# Altium schematic sheet Power_subsystem.SchDoc
size B; Organization: Altium Limited; Address1: L3, 12a Rodborough Rd; Address2: Frenchs Forest; Address3: NSW; Address4: Australia 2086
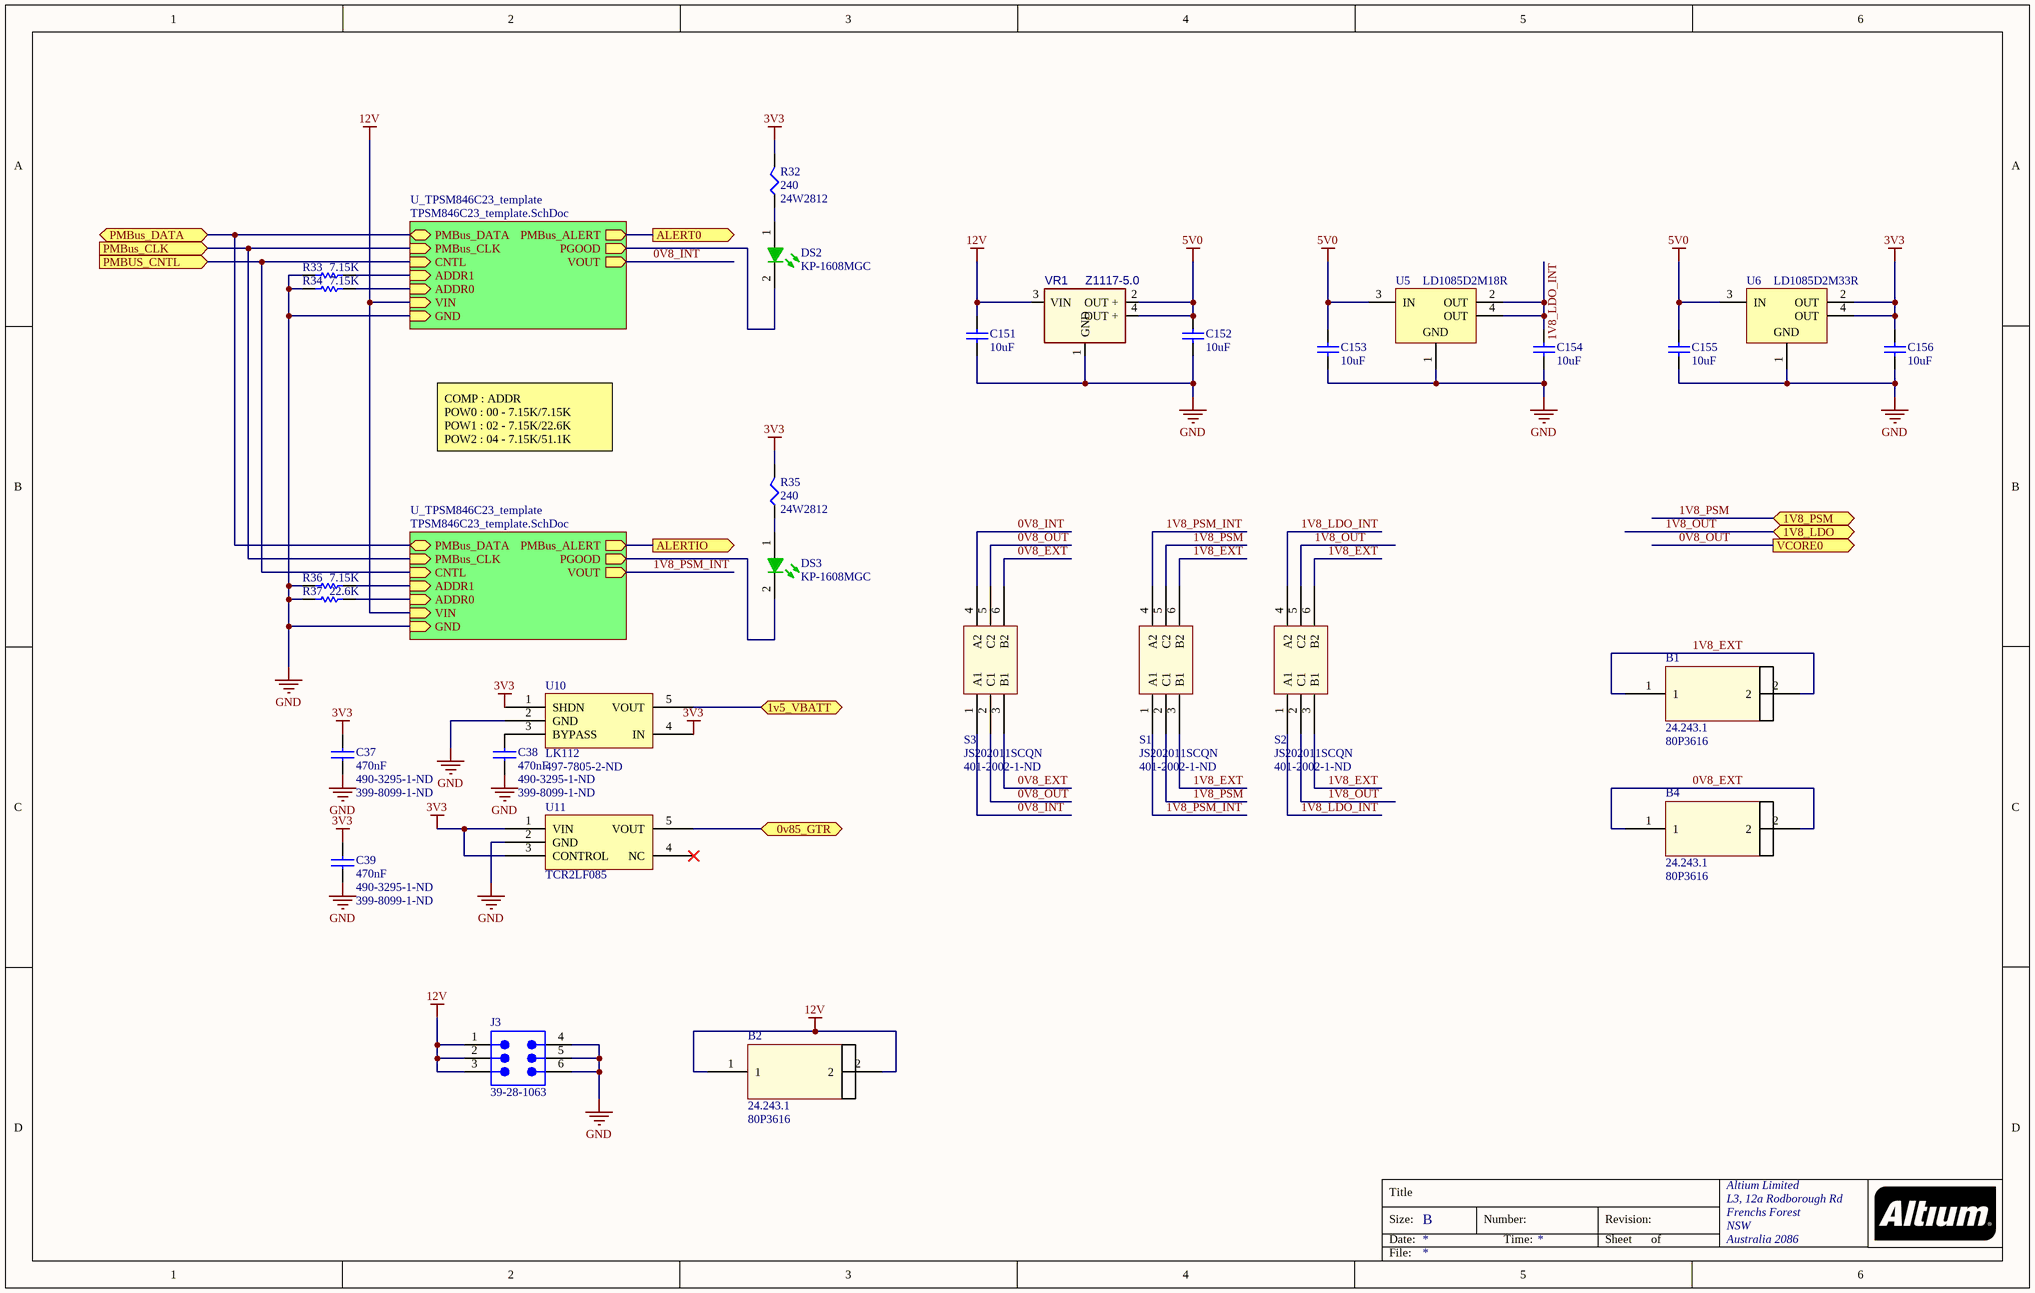
[diagram p0: Power_subsystem.SchDoc]

## Parts
B1  24.243.1  Supplier Part Number 1: 80P3616  [banana_clip]
B2  24.243.1  Supplier Part Number 1: 80P3616  [banana_clip]
B4  24.243.1  Supplier Part Number 1: 80P3616  [banana_clip]
C37  Capacitance: 470nF  Supplier Part Number 1: 490-3295-1-ND  Supplier Part Number 2: 399-8099-1-ND  [CAPC1005X06N]  (hidden comment: CAP_470nF_1608mm_0603mil_1)
C38  Capacitance: 470nF  Supplier Part Number 1: 490-3295-1-ND  Supplier Part Number 2: 399-8099-1-ND  [CAPC1005X06N]  (hidden comment: CAP_470nF_1608mm_0603mil_1)
C39  Capacitance: 470nF  Supplier Part Number 1: 490-3295-1-ND  Supplier Part Number 2: 399-8099-1-ND  [CAPC1005X06N]  (hidden comment: CAP_470nF_1608mm_0603mil_1)
C151  10uF  [CAPC0805(2012)145_N]
C152  10uF  [CAPC0805(2012)145_N]
C153  10uF  [CAPC0805(2012)145_N]
C154  10uF  [CAPC0805(2012)145_N]
C155  10uF  [CAPC0805(2012)145_N]
C156  10uF  [CAPC0805(2012)145_N]
DS2  KP-1608MGC  [KING-0603LED_GREEN_V]
DS3  KP-1608MGC  [KING-0603LED_GREEN_V]
J3  39-28-1063  [MOLX-39-28-1063_V]
R32  Resistance: 240  Supplier Part Number 1: 24W2812  [RESC1608X06N]  (hidden comment: RES_240_0603)
R33  7.15K  [RESC0402(1005)_N]
R34  7.15K  [RESC0402(1005)_N]
R35  Resistance: 240  Supplier Part Number 1: 24W2812  [RESC1608X06N]  (hidden comment: RES_240_0603)
R36  7.15K  [RESC0402(1005)_N]
R37  22.6K  [RESC0402(1005)_N]
S1  JS202011SCQN  Supplier Part Number 1: 401-2002-1-ND  [JS202011SCQN_auto]
S2  JS202011SCQN  Supplier Part Number 1: 401-2002-1-ND  [JS202011SCQN_auto]
S3  JS202011SCQN  Supplier Part Number 1: 401-2002-1-ND  [JS202011SCQN_auto]
U5  LD1085D2M18R  [D2PAK_A_M]
U6  LD1085D2M33R  [D2PAK_A_L]
U10  LK112  Supplier Part Number 1: 497-7805-2-ND  [SOT95P280X110-5N]
U11  TCR2LF085  [SOT95P280X110-5N]
VR1  Z1117-5.0  [SOT-223]

## Sub-sheets
U_TPSM846C23_template = TPSM846C23_template.SchDoc: PMBus_DATA (bidir), PMBus_CLK (in), PMBus_ALERT (out), CNTL (in), ADDR1 (in), ADDR0 (in), PGOOD (out), VIN (in), GND (in), VOUT (out)
U_TPSM846C23_template = TPSM846C23_template.SchDoc: PMBus_DATA (bidir), PMBus_CLK (in), PMBus_ALERT (out), CNTL (in), ADDR1 (in), ADDR0 (in), PGOOD (out), VIN (in), GND (in), VOUT (out)

## Ports
0v85_GTR (bidir), 1v5_VBATT (bidir), 1V8_LDO (bidir), 1V8_PSM (bidir), ALERT0 (out), ALERTIO (out), PMBus_CLK (in), PMBUS_CNTL (in), PMBus_DATA (bidir), VCORE0 (out)

## Nets
3V3: C37.1 C39.1 C156.2 R32.1 R35.1 U6.2(OUT) U6.4(OUT) U10.1(SHDN) U10.4(IN) U11.1(VIN) U11.3(CONTROL)
5V0: C152.2 C153.2 C155.2 U5.3(IN) U6.3(IN) VR1.2(OUT_+) VR1.4(OUT_+)
12V: B2.1 B2.2 C151.2 J3.1 J3.2 J3.3 VR1.3(VIN) ; sheet U_TPSM846C23_template/VIN, sheet U_TPSM846C23_template/VIN
GND: C37.2 C38.2 C39.2 C151.1 C152.1 C153.1 C154.1 C155.1 C156.1 J3.4 J3.5 J3.6 R33.1 R34.1 R36.1 R37.1 U5.1(GND) U6.1(GND) U10.2(GND) U11.2(GND) VR1.1(GND) ; sheet U_TPSM846C23_template/GND, sheet U_TPSM846C23_template/GND
0V8_EXT: B4.1 B4.2 S3.3(B1) S3.6(B2)
0V8_INT: S3.1(A1) S3.4(A2) ; sheet U_TPSM846C23_template/VOUT
0V8_OUT: S3.2(C1) S3.5(C2) ; port VCORE0
0v85_GTR: U11.5(VOUT) ; port 0v85_GTR
1v5_VBATT: U10.5(VOUT) ; port 1v5_VBATT
1V8_EXT: B1.1 B1.2 S1.3(B1) S1.6(B2) S2.3(B1) S2.6(B2)
1V8_LDO_INT: C154.2 S2.1(A1) S2.4(A2) U5.2(OUT) U5.4(OUT)
1V8_OUT: S2.2(C1) S2.5(C2) ; port 1V8_LDO
1V8_PSM: S1.2(C1) S1.5(C2) ; port 1V8_PSM
1V8_PSM_INT: S1.1(A1) S1.4(A2) ; sheet U_TPSM846C23_template/VOUT
ALERT0: port ALERT0, sheet U_TPSM846C23_template/PMBus_ALERT
ALERTIO: port ALERTIO, sheet U_TPSM846C23_template/PMBus_ALERT
PMBus_CLK: port PMBus_CLK, sheet U_TPSM846C23_template/PMBus_CLK, sheet U_TPSM846C23_template/PMBus_CLK
PMBUS_CNTL: port PMBUS_CNTL, sheet U_TPSM846C23_template/CNTL, sheet U_TPSM846C23_template/CNTL
PMBus_DATA: port PMBus_DATA, sheet U_TPSM846C23_template/PMBus_DATA, sheet U_TPSM846C23_template/PMBus_DATA
NetC38_1: C38.1 U10.3(BYPASS)
NetDS2_1: DS2.1(A) R32.2
NetDS2_2: DS2.2(K) ; sheet U_TPSM846C23_template/PGOOD
NetDS3_1: DS3.1(A) R35.2
NetDS3_2: DS3.2(K) ; sheet U_TPSM846C23_template/PGOOD
NetR33_2: R33.2 ; sheet U_TPSM846C23_template/ADDR1
NetR34_2: R34.2 ; sheet U_TPSM846C23_template/ADDR0
NetR36_2: R36.2 ; sheet U_TPSM846C23_template/ADDR1
NetR37_2: R37.2 ; sheet U_TPSM846C23_template/ADDR0

Not connected (* = marked no-connect by the designer): U11 4(NC)*

## Notes on the sheet
- COMP : ADDR
  POW0 : 00 - 7.15K/7.15K
  POW1 : 02 - 7.15K/22.6K
  POW2 : 04 - 7.15K/51.1K
- Title
- Size:
- Date:
- B
- Number:
- Time:
- Revision:
- Sheet
- of
- File:

## Library data of the parts
C37-C39 = CAP_470nF_1608mm_0603mil_1: 0.47uF Capacitor; Manufacturer: Murata; Manufacturer Part Number: GRM155R61E225ME15D; Voltage Rating: 25V; Tolerance: 20%; Dielectric: X5R; ComponentLink1URL: http://search.murata.co.jp/Ceramy/image/img/A01X/G101/ENG/GRM0335C1E120JA01-01.pdf; ComponentLink1Description: http://search.murata.co.jp/Ceramy/image/img/A01X/G101/ENG/GRM0335C1E120JA01-01.pdf; ComponentLink2URL: http://search.murata.co.jp/Ceramy/image/img/A01X/partnumbering_e_01.pdf; ComponentLink2Description: http://search.murata.co.jp/Ceramy/image/img/A01X/partnumbering_e_01.pdf; ComponentLink3URL: http://www1.futureelectronics.com/doc/SAMSUNG/CL03A104KQ3NNNC.pdf; ComponentLink3Description: http://www1.futureelectronics.com/doc/SAMSUNG/CL03A104KQ3NNNC.pdf; ComponentLink4URL: https://www.distrelec.biz/Web/Downloads/_e/ng/MLCC_CatalogDownload2013_ENG.pdf?mime=application%2Fpdf; ComponentLink4Description: https://www.distrelec.biz/Web/Downloads/_e/ng/MLCC_CatalogDownload2013_ENG.pdf?mime=application%2Fpdf; ComponentLink5URL: https://www.verical.com/server-webapp/html/getDatasheet?partID=355266; ComponentLink5Description: https://www.verical.com/server-webapp/html/getDatasheet?partID=355266; ComponentLink6URL: http://psearch.murata.com/capacitor/product/GCM155R71H103KA55%23.pdf; ComponentLink6Description: http://psearch.murata.com/capacitor/product/GCM155R71H103KA55%23.pdf; ComponentLink7URL: https://www.verical.com/server-webapp/html/getDatasheet?partID=27433; ComponentLink7Description: https://www.verical.com/server-webapp/html/getDatasheet?partID=27433; ComponentLink8URL: http://psearch.en.murata.com/capacitor/product/GCM155R71H103KA55%23.pdf; ComponentLink8Description: http://psearch.en.murata.com/capacitor/product/GCM155R71H103KA55%23.pdf; ComponentLink9URL: http://search.murata.co.jp/Ceramy/image/img/A01X/partnumbering_e_02.pdf; ComponentLink9Description: http://search.murata.co.jp/Ceramy/image/img/A01X/partnumbering_e_02.pdf; ComponentLink10URL: http://uk.rs-online.com/webdocs/0ef9/0900766b80ef92d0.pdf; ComponentLink10Description: http://uk.rs-online.com/webdocs/0ef9/0900766b80ef92d0.pdf; Stock 1: 100000; Pricing 1: 1=0.34, 10=0.23, 100=0.1163, 500=0.0796, 1000=0.07041, 2500=0.06735, 5000=0.06123 (USD); Mount: Surface Mount; Case/Package: 0402; Weight: 0.000212oz; Case Code (Metric): 1005; Case Code (Imperial): 0402; Min Operating Temperature: -55°C; Max Operating Temperature: 85°C; Packaging: Tape and Reel; Termination: SMD/SMT; Voltage Rating (DC): 25V; Package Quantity: 10000; Length: 0.039inch; Height: 0.5mm; Width: 0.02inch; Thickness: 0.022inch; Supplier 1: Digi-Key; Supplier 2: Digi-Key
C151-C156 = CAP_0805
DS2 DS3 = CMP-0404-00001-1: LED, SMT, 0603(1608), 1.1mm thickness, Green; Manufacturer: Kingbright; Reverse Voltage: 5 V; Power Dissipation: 75 mW; Forward Current: 30 mA; Packing Type: 2000 pcs / reel; Mounting Technology: Surface Mount; Storage Temperature: -40 to +85 degC; ComponentLink1URL: http://www.kingbright.com/; PackageDescription: 2-Pin SMT LED, 1.6 x 0.8 mm Pitch; PartNumber: KP-1608MGC; PackageReference: 0603LED_GREEN; ComponentLink1Description: Manufacturer URL
J3 = CMP-1594-00001-1: 4.2 mm Pitch Mini-Fit Jr.Power Connector, Vertical, Through Hole, 6 Circuits, -40 to 105 degC, RoHS, Bag; Pitch: 4.2 mm; No. of Positions: 6; No. of Rows: 2; PartNumber: 39-28-1063; ComponentLink3Description: Package Specification; ComponentLink1URL: http://www.molex.com/; PackageVersion: Rev. F, 06/2009; Orientation: Vertical; ComponentLink3URL: http://www.molex.com/pdm_docs/sd/039281063_sd.pdf; ComponentLink2Description: Datasheet; PackageDescription: 6-Pin PCB Header, Vertical, Pitch 4.2 mm, Through Hole; ComponentLink1Description: Manufacturer URL; Temperature Min: -40 degC; RoHS: TRUE; Packing: Bag; Mounting Technology: Through Hole; Temperature Max: 105 degC; ComponentLink2URL: http://www.molex.com/webdocs/datasheets/pdf/en-us/0039281063_PCB_HEADERS.pdf
R32 R35 = RES_240_0603: Res Thin Film 0603 240 Ohm 0.1% 0.1W(1/10W) ±25ppm/C Molded SMD Automotive Punched T/R; Manufacturer: Panasonic; Manufacturer Part Number: ERA-3AEB101V; Power Rating: 100mW; Voltage Rating: 75V; Temperature Coefficient: 25ppm/°C; ComponentLink1URL: https://www.rohm.com/datasheet/ESR01MZPF/esr-e; ComponentLink1Description: https://www.rohm.com/datasheet/ESR01MZPF/esr-e; Stock 1: 511300; Pricing 1: 1=0.35, 10=0.3, 100=0.1172, 1000=0.04906, 2500=0.04498 (USD); Mount: Surface Mount; Case/Package: 0603; Number of Pins: 2; Case Code (Metric): 1608; Case Code (Imperial): 0603; Contact Plating: Tin; Min Operating Temperature: -55°C; Max Operating Temperature: 155°C; Tolerance: 0.1%; Packaging: Tape and Reel; Package Quantity: 5000; Composition: Metal Film,Thin Film; Number of Terminations: 2; Termination: SMD/SMT; Military Standard: Not; Max Power Dissipation: 100mW; Length: 1.6mm; Height: 0.45mm; Width: 0.8mm; Depth: 0.8mm; Radiation Hardening: No; REACH SVHC: No SVHC; ComponentLink2URL: http://www.farnell.com/datasheets/485442.pdf; ComponentLink2Description: http://www.farnell.com/datasheets/485442.pdf; ComponentLink3URL: http://industrial.panasonic.com/www-data/pdf/AOA0000/AOA0000CE26.pdf; ComponentLink3Description: http://industrial.panasonic.com/www-data/pdf/AOA0000/AOA0000CE26.pdf; ComponentLink4URL: http://www.farnell.com/datasheets/2059650.pdf; ComponentLink4Description: http://www.farnell.com/datasheets/2059650.pdf; ComponentLink5URL: http://www.farnell.com/datasheets/39837.pdf; ComponentLink5Description: http://www.farnell.com/datasheets/39837.pdf; ComponentLink6URL: http://uk.rs-online.com/webdocs/0fe2/0900766b80fe20f7.pdf; ComponentLink6Description: http://uk.rs-online.com/webdocs/0fe2/0900766b80fe20f7.pdf; ComponentLink7URL: https://www.alliedelec.com/m/d/b6b0537e86f421aa7f5975bb1d8f429a.pdf; ComponentLink7Description: https://www.alliedelec.com/m/d/b6b0537e86f421aa7f5975bb1d8f429a.pdf; ComponentLink8URL: https://www.distrelec.biz/Web/Downloads/_t/ds/ERA_eng_tds.pdf?mime=application%2Fpdf; ComponentLink8Description: https://www.distrelec.biz/Web/Downloads/_t/ds/ERA_eng_tds.pdf?mime=application%2Fpdf; ComponentLink9URL: http://www.produktinfo.conrad.com/datenblaetter/450000-474999/450355-da-01-en-WIDERSTAND_0603_ERA.pdf; ComponentLink9Description: http://www.produktinfo.conrad.com/datenblaetter/450000-474999/450355-da-01-en-WIDERSTAND_0603_ERA.pdf; Supplier 1: Newark
R33 R34 R36 R37 = RES_0402
U5 = CMP-0244-00504-1: 3A, Low Drop Positive Voltage Regulator, 1.8V, 4-Pin D2PAK/A; PackageVersion: 2011; ComponentLink1Description: Manufacturer URL; PackageReference: D2PAK_A; PackageDescription: 4-Pin Transistor Outline Package 2.54 mm Pitch, 15.4 mm Lead Span; ComponentLink2Description: Datasheet; DatasheetVersion: 28/07/2009; ComponentLink2URL: http://www.st.com/internet/com/TECHNICAL_RESOURCES/TECHNICAL_LITERATURE/DATASHEET/CD00001883.pdf; ComponentLink1URL: http://www.st.com
U6 = CMP-0244-00506-1: 3A, Low Drop Positive Voltage Regulator, 3.3V, 4-Pin D2PAK/A; PackageVersion: 2011; ComponentLink1URL: http://www.st.com; ComponentLink1Description: Manufacturer URL; PackageReference: D2PAK_A; ComponentLink2Description: Datasheet; ComponentLink2URL: http://www.st.com/internet/com/TECHNICAL_RESOURCES/TECHNICAL_LITERATURE/DATASHEET/CD00001883.pdf; PackageDescription: 4-Pin Transistor Outline Package 2.54 mm Pitch, 15.4 mm Lead Span; DatasheetVersion: 28/07/2009
U10 = LK112: 1.5V regulator; ComponentLink1Description: TCR2LF085; ComponentLink1URL: https://www.digikey.com/en/products/detail/toshiba-semiconductor-and-storage/TCR2LF085-LM-CT/10379974; Supplier 1: Digi-Key
U11 = TCR2LF085: 0.85V regulator; ComponentLink1Description: TCR2LF085; ComponentLink1URL: https://www.digikey.com/en/products/detail/toshiba-semiconductor-and-storage/TCR2LF085-LM-CT/10379974
VR1 = ZLDO1117: IC REG LDO 1A SOT223-3; Mfr Part Number: ZLDO1117G50TA; Manufacturer: Diodes; Mfr Part Description: IC REG LDO 5V 1A SOT223-3; ID: 60187; Voltage_Rating: 5V; Updated By: User 3; Sub_Type: Vreg; Part_Type: IC; Value: Z1117-5.0; Supplier 1: Digi-Key; Supplier Part Number 1: ZLDO1117G50DICT-ND; Package_Case: TO-261-4, TO-261AA; RoHS: Yes; Temperature Range: -40C to +125C; Current_Rating: 1A; Created By: murbach; LifeCycle: New; ComponentLink1Description: Datasheets; ComponentLink1URL: http://www.diodes.com/datasheets/ZLDO1117.pdf; ComponentLink2Description: Supplier Part Details; ComponentLink2URL: http://www.digikey.com/product-detail/en/ZLDO1117G50TA/ZLDO1117G50DICT-ND; Created_Date: 2014/11/24 21:28:44; Updated_Date: 2016/06/22 20:05:00
B1 B2 B4 = 24.243.1: Supplier 1: Newark
S1-S3 = JS202011SCQN: Supplier 1: Digi-Key